# EAGLE design PROJECT_2 (EAGLE 9.6.2)
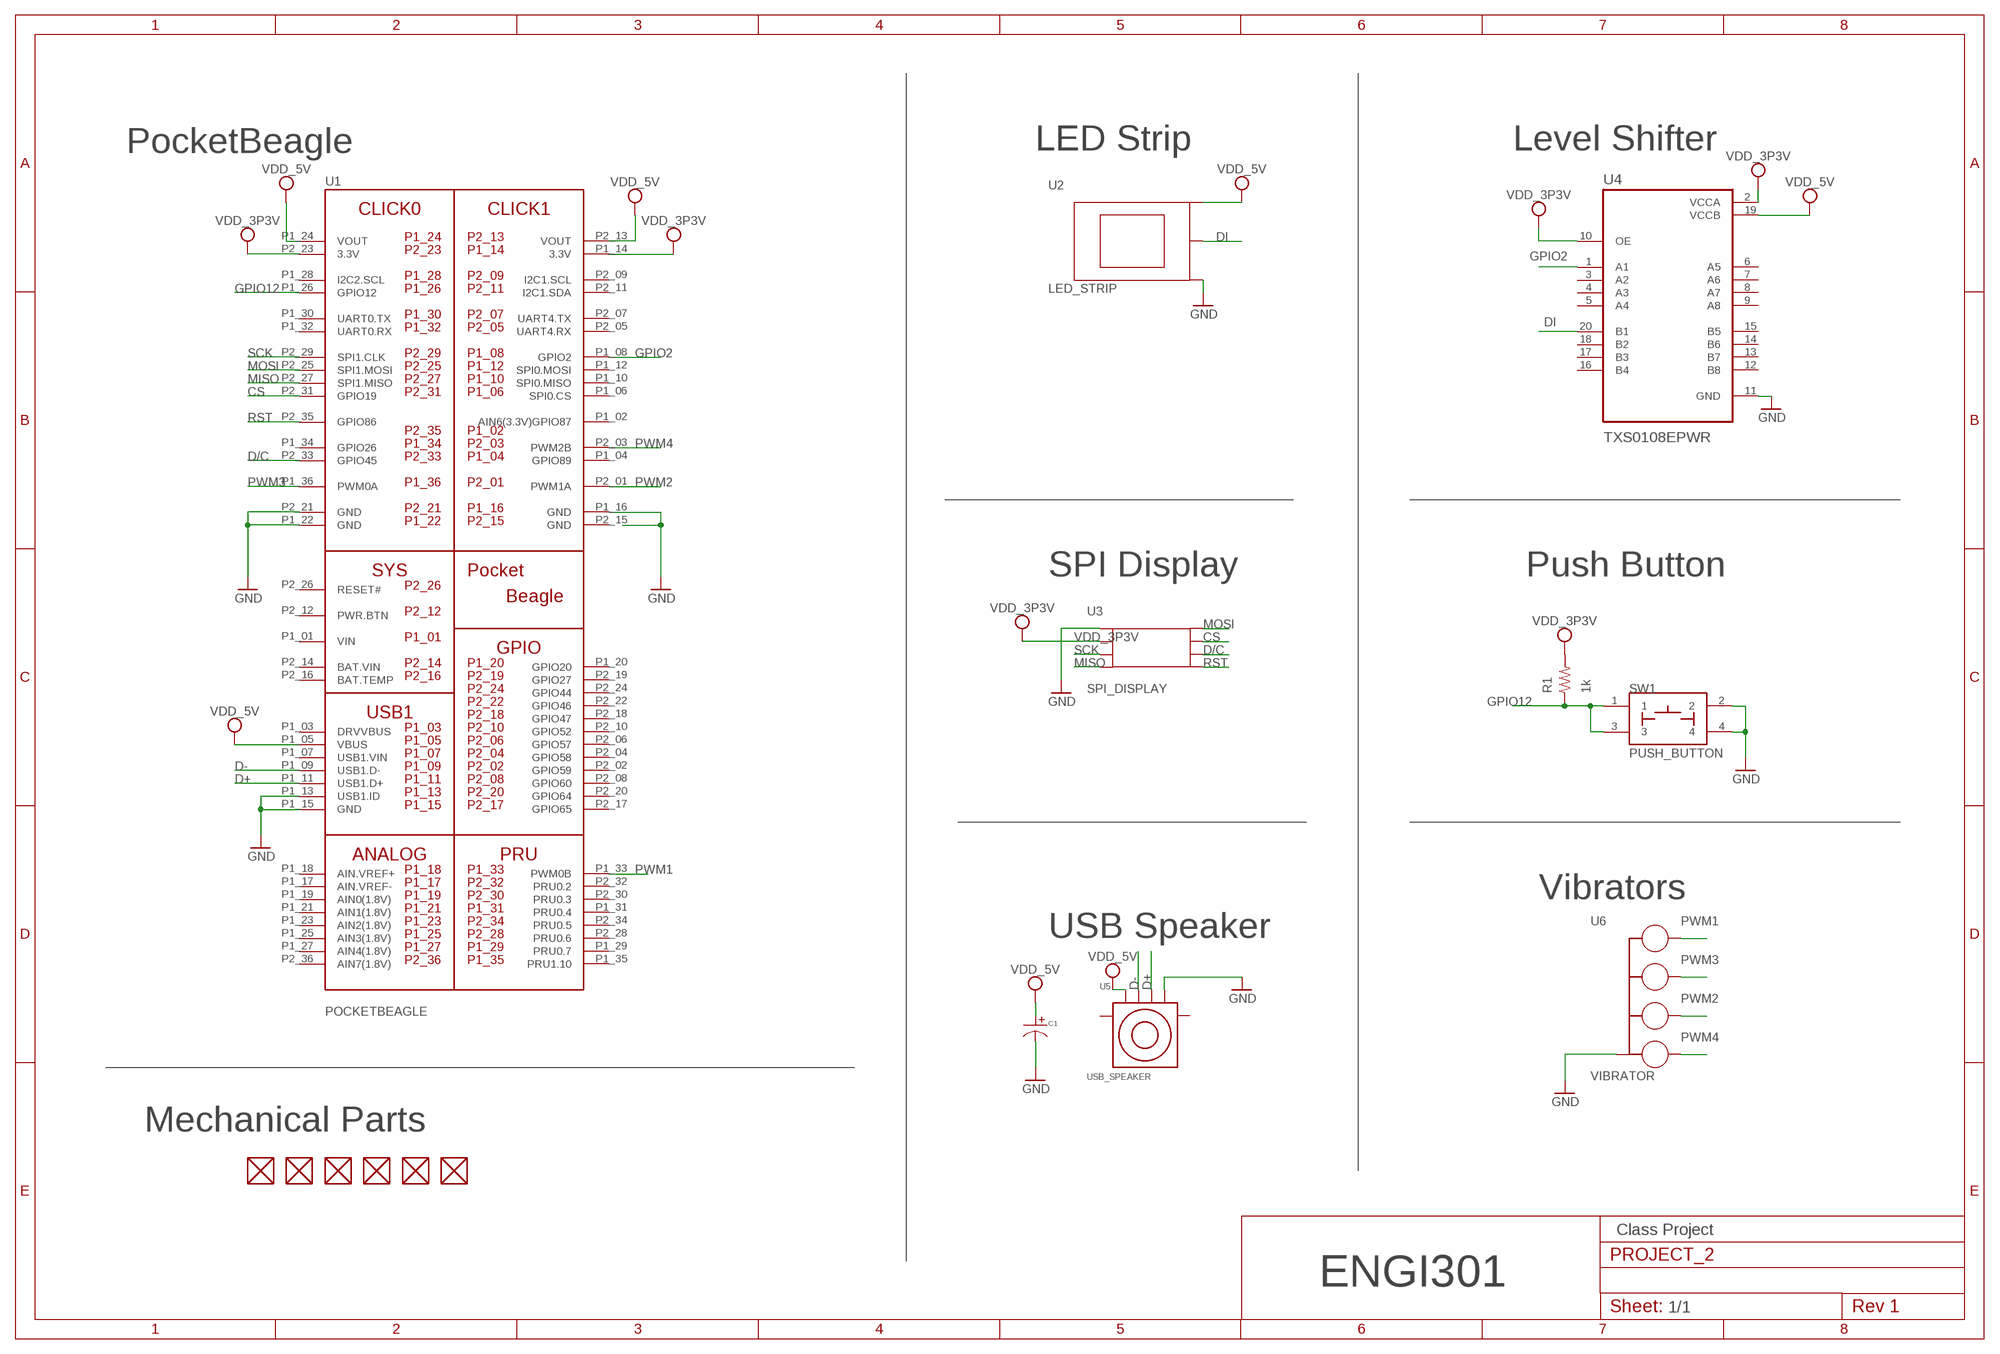
[diagram p0: schematic, sheet 1]

## Parts
C1  CAPACITOR_P_10MM  [CP10MM]
FUD1  FIDUCIAL  [FIDUCIAL_40MIL]
FUD2  FIDUCIAL  [FIDUCIAL_40MIL]
FUD3  FIDUCIAL  [FIDUCIAL_40MIL]
FUD4  FIDUCIAL  [FIDUCIAL_40MIL]
FUD5  FIDUCIAL  [FIDUCIAL_40MIL]
FUD6  FIDUCIAL  [FIDUCIAL_40MIL]
R1  1k  R_R0603  [R0603]
SW1  PUSH_BUTTON  [BUTTON_12.5MM]
U1  POCKETBEAGLE  [POCKETBEAGLE]
U2  LED_STRIP  [LED_HEADERS]
U3  SPI_DISPLAY  [SPI_DISPLAY]
U4  TXS0108EPWR  [SOP65P640X120-20N]
U5  USB_SPEAKER  [USB_CONNECTOR]
U6  VIBRATOR  [VIBRATOR_HEADERS]

## Nets
CS: U1.P2_31(GPIO19) U3.TFT-CS(CS)
D+: U1.P1_11(USB1.D+) U5.D+
D-: U1.P1_09(USB1.D-) U5.D-
D/C: U1.P2_33(GPIO45) U3.D/C
DI: U2.SIG U4.20(B1)
GND: C1.P$2 SW1.2 SW1.4 U1.P1_13(USB1.ID) U1.P1_15(GND) U1.P1_16(GND) U1.P1_22(GND) U1.P2_21(GND) U2.GND U3.GND U4.11(GND) U5.GND U6.GND
GPIO2: U1.P1_08(GPIO2) U4.1(A1)
GPIO12: R1.1 SW1.1 SW1.3 U1.P1_26(GPIO12)
MISO: U1.P2_27(SPI1.MISO) U3.MISO
MOSI: U1.P2_25(SPI1.MOSI) U3.MOSI
PWM1: U1.P1_33(PWM0B) U6.PWM1
PWM2: U1.P2_01(PWM1A) U6.PWM3
PWM3: U1.P1_36(PWM0A) U6.PWM2
PWM4: U1.P2_03(PWM2B) U6.PWM4
RST: U1.P2_35(GPIO86) U3.RST
SCK: U1.P2_29(SPI1.CLK) U3.SCK
VDD_3P3V: R1.2 U1.P1_14(3.3V) U1.P2_23(3.3V) U3.VCC U4.2(VCCA) U4.10(OE)
VDD_5V: C1.P$1 U1.P1_05(VBUS) U1.P1_24(VOUT) U1.P2_13(VOUT) U2.PWR(VIN) U4.19(VCCB) U5.VBUS
Unconnected: FUD1.P$1 FUD2.P$1 FUD3.P$1 FUD4.P$1 FUD5.P$1 FUD6.P$1 U1.P1_02(AIN6(3.3V)GPIO87) U1.P1_03(DRVVBUS) U1.P1_04(GPIO89) U1.P1_06(SPI0.CS) U1.P1_07(USB1.VIN) U1.P1_10(SPI0.MISO) U1.P1_12(SPI0.MOSI) U1.P1_17(AIN.VREF-) U1.P1_18(AIN.VREF+) U1.P1_19(AIN0(1.8V)) U1.P1_20(GPIO20) U1.P1_21(AIN1(1.8V)) U1.P1_23(AIN2(1.8V)) U1.P1_25(AIN3(1.8V)) U1.P1_27(AIN4(1.8V)) U1.P1_28(I2C2.SCL) U1.P1_29(PRU0.7) U1.P1_30(UART0.TX) U1.P1_31(PRU0.4) U1.P1_32(UART0.RX) U1.P1_34(GPIO26) U1.P1_35(PRU1.10) U1.P2_02(GPIO59) U1.P2_04(GPIO58) U1.P2_05(UART4.RX) U1.P2_06(GPIO57) U1.P2_07(UART4.TX) U1.P2_08(GPIO60) U1.P2_09(I2C1.SCL) U1.P2_10(GPIO52) U1.P2_11(I2C1.SDA) U1.P2_12(PWR.BTN) U1.P2_16(BAT.TEMP) U1.P2_17(GPIO65) U1.P2_18(GPIO47) U1.P2_19(GPIO27) U1.P2_20(GPIO64) U1.P2_22(GPIO46) U1.P2_24(GPIO44) U1.P2_26(RESET#) U1.P2_28(PRU0.6) U1.P2_30(PRU0.3) U1.P2_32(PRU0.2) U1.P2_34(PRU0.5) U1.P2_36(AIN7(1.8V)) U4.3(A2) U4.4(A3) U4.5(A4) U4.6(A5) U4.7(A6) U4.8(A7) U4.9(A8) U4.12(B8) U4.13(B7) U4.14(B6) U4.15(B5) U4.16(B4) U4.17(B3) U4.18(B2) U5.SHIELD@1(CGND) U5.SHIELD@2(CGND1)

## Notes on the sheet
- PocketBeagle | LED Strip | Level Shifter
- SPI Display | Push Button
- Vibrators
- USB Speaker
- Mechanical Parts
- Class Project
- ENGI301
- 1/1

## Power pins joined to a net without a drawn wire
BAT.VIN: U1.P2_14(BAT.VIN)
GND: U1.P2_15(GND)
VIN: U1.P1_01(VIN)

## Library data of the parts
C1 = MF_Passives:CAPACITOR_P: Library: MF_Passives Description: Device for Polarized Capacitors. Manufacture part number (MPN), Voltage Rating, and Tolerance can be added via Attributes. Check https://factory.macrofab.com/parts for the house parts list.; POPULATE: 1
FUD1-FUD6 = combo_lock:FIDUCIAL
R1 = Project_2:R_: RESISTOR, American symbol
SW1 = Project_2:PUSH_BUTTON
U1 = Project_2:POCKETBEAGLE
U2 = Project_2:LED_STRIP: LED Strip
U3 = Project_2:SPI_DISPLAY: 1.8" Color TFT LCD display
U4 = Project_2:TXS0108EPWR: Check prices <https://pricing.snapeda.com/parts/TXS0108EPWR/Texas%20Instruments/view-part?ref=eda>; AVAILABILITY: In Stock; DESCRIPTION: 8-bit bidirectional voltage-level shifter for open-drain and push-pull application 20-TSSOP -40 to 85; MF: Texas Instruments; MP: TXS0108EPWR; PACKAGE: TSSOP-20 Texas Instruments; PRICE: None; PURCHASE-URL: https://pricing.snapeda.com/search/part/TXS0108EPWR/?ref=eda
U5 = Project_2:USB_SPEAKER
U6 = Project_2:VIBRATOR: Vibration motor

## Board
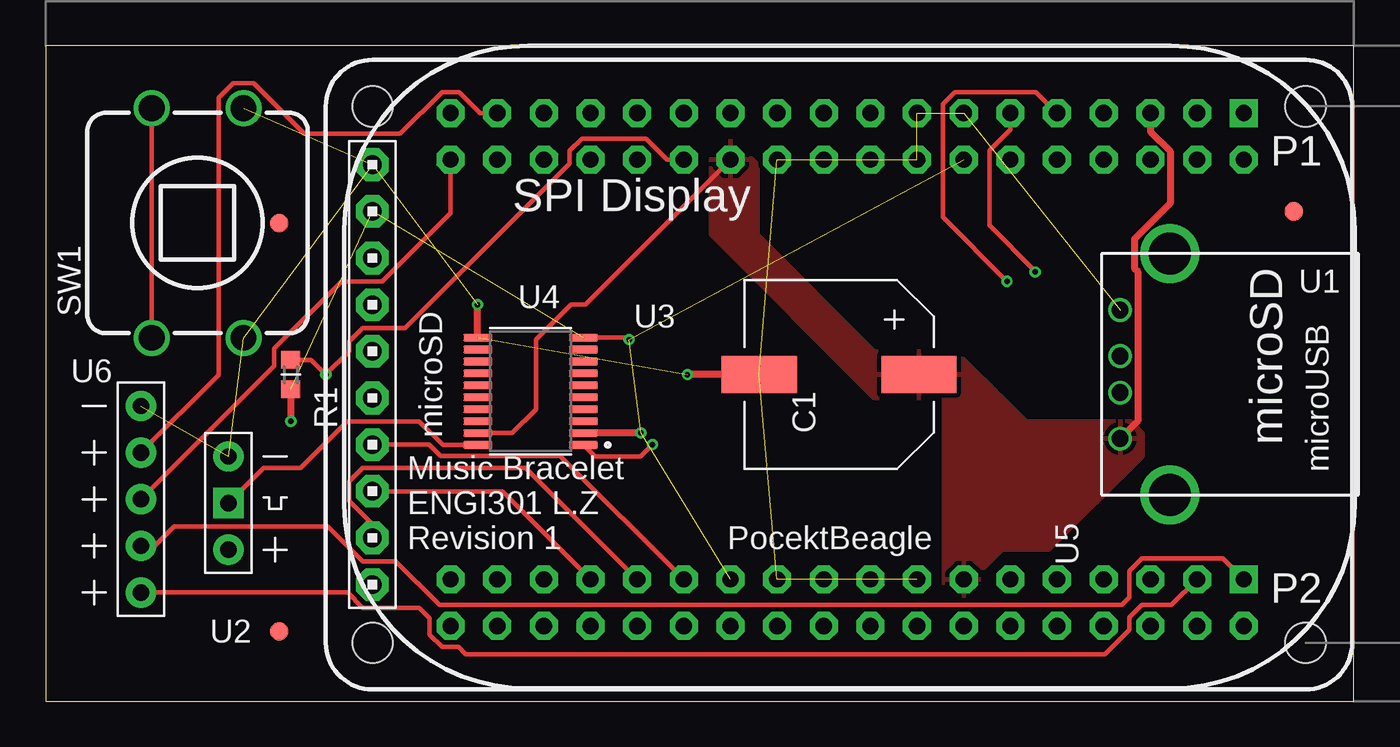
[diagram p1: board, top side]
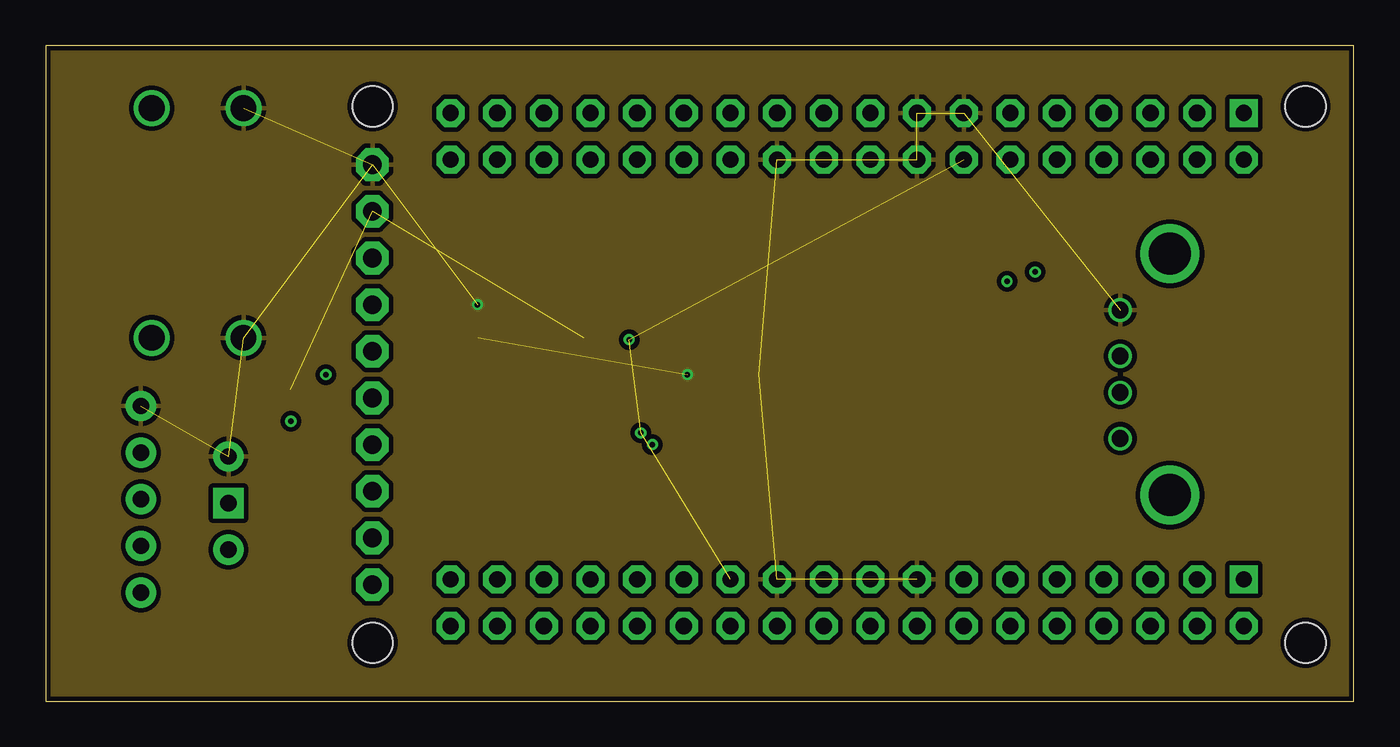
[diagram p2: board, inner layer Route2]
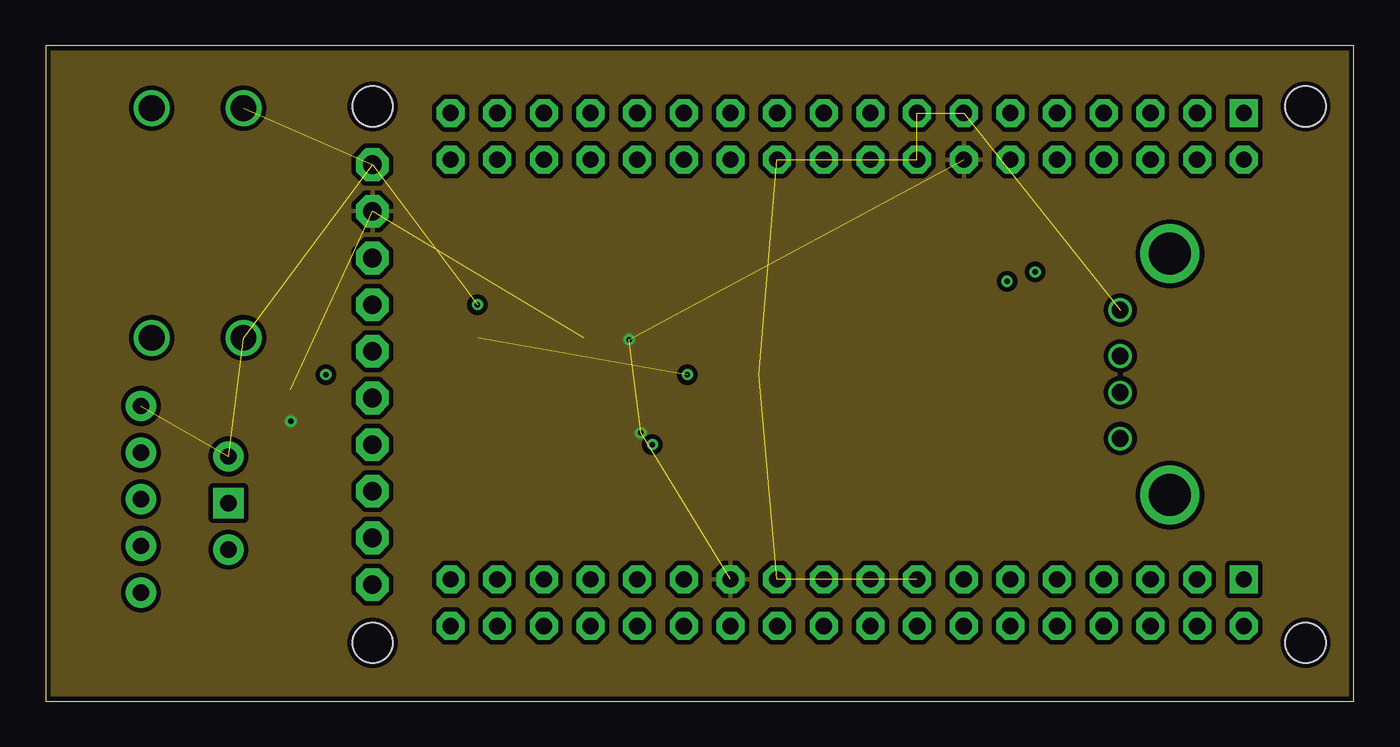
[diagram p3: board, inner layer Route15]
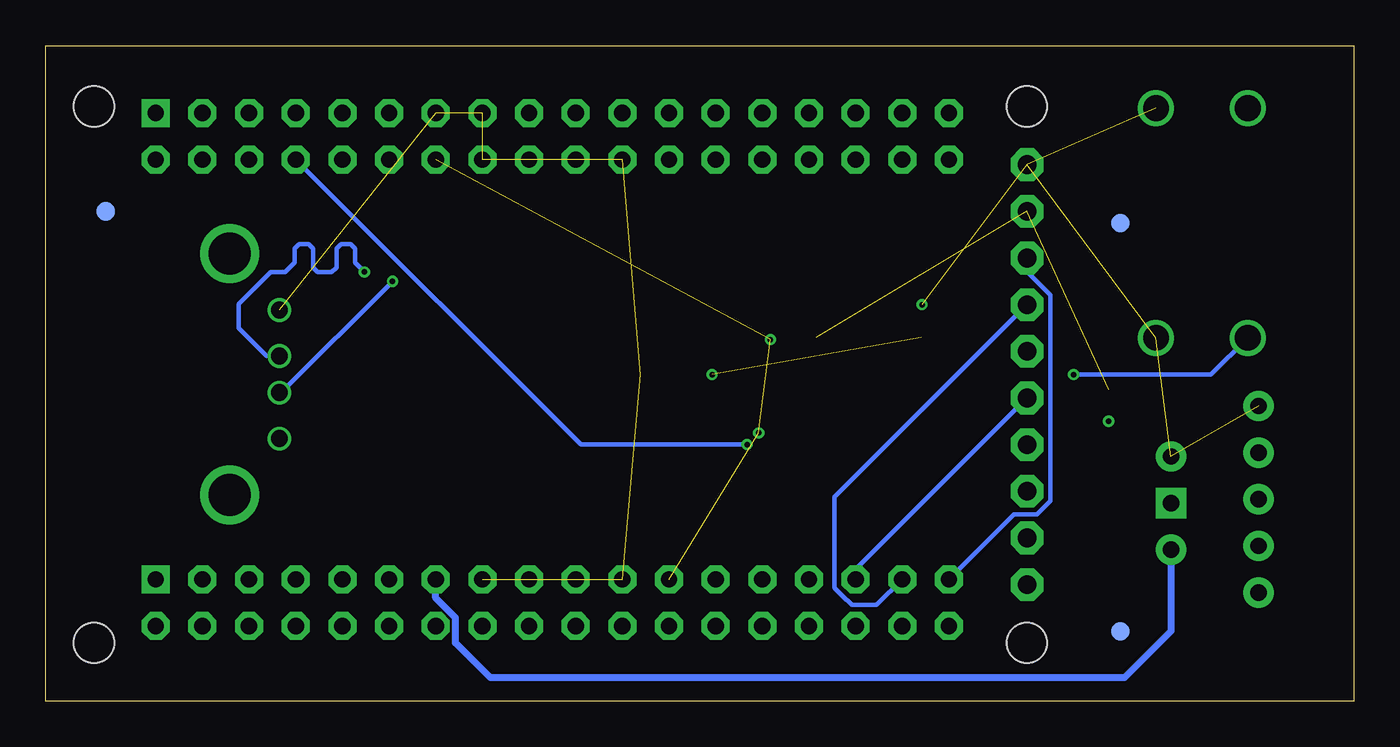
[diagram p4: board, bottom side, seen from below]

Size 71.19 x 35.68 mm. Coordinates in mm from the lower left corner, seen from the top.
Outline: 0,0 71.19,0 71.19,35.68 0,35.68 0,0
Copper layers (1*2*15*16): Top 0.035mm / dielectric 0.23mm / Route2 0.035mm / dielectric 0.93mm / Route15 0.035mm / dielectric 0.23mm / Bottom 0.035mm
Design rules "ENGI301_4lyr *": minimum track width 10mil, minimum drill 12mil, track to track 10mil, track to pad 5mil, pad to pad 5mil, via to via 10mil, smd to smd 10mil, copper to edge 10mil, drill to drill 12mil, minimum pad ring 6mil, minimum via ring 6mil, stop-mask expansion 3mil, vias tented up to drill 25mil, thermal gap 10mil

### Footprints (pad centres in the part's own frame; a part is rotated, then mirrored left to right if it is on the bottom)
CP10MM = smd 2 x 4.1: P$1 0,-4.35; P$2 0,4.35
FIDUCIAL_40MIL = smd 1.016 x 1.016: P$1 0,0
R0603 = smd 0.95 x 1.031: 1 -0.8,0; 2 0.8,0
BUTTON_12.5MM = drill 1.4: 1 -6.25,2.5; 2 -6.25,-2.5; 3 6.25,2.5; 4 6.25,-2.5
POCKETBEAGLE = drill 0.889 pad 1.524 square: P1_01 5.91,3.53; P2_01 5.91,28.93 | drill 0.889 pad 1.524 octagon: P1_02 5.91,6.07; P1_03 8.45,3.53; P1_04 8.45,6.07; P1_05 10.99,3.53; P1_06 10.99,6.07; P1_07 13.53,3.53; P1_08 13.53,6.07; P1_09 16.07,3.53; P1_10 16.07,6.07; P1_11 18.61,3.53; P1_12 18.61,6.07; P1_13 21.15,3.53; P1_14 21.15,6.07; P1_15 23.69,3.53; P1_16 23.69,6.07; P1_17 26.23,3.53; P1_18 26.23,6.07; P1_19 28.77,3.53; P1_20 28.77,6.07; P1_21 31.31,3.53; P1_22 31.31,6.07; P1_23 33.85,3.53; P1_24 33.85,6.07; P1_25 36.39,3.53; P1_26 36.39,6.07; P1_27 38.93,3.53; P1_28 38.93,6.07; P1_29 41.47,3.53; P1_30 41.47,6.07; P1_31 44.01,3.53; P1_32 44.01,6.07; P1_33 46.55,3.53; P1_34 46.55,6.07; P1_35 49.09,3.53; P1_36 49.09,6.07; P2_02 5.91,31.47; P2_03 8.45,28.93; P2_04 8.45,31.47; P2_05 10.99,28.93; P2_06 10.99,31.47; P2_07 13.53,28.93; P2_08 13.53,31.47; P2_09 16.07,28.93; P2_10 16.07,31.47; P2_11 18.61,28.93; P2_12 18.61,31.47; P2_13 21.15,28.93; P2_14 21.15,31.47; P2_15 23.69,28.93; P2_16 23.69,31.47; P2_17 26.23,28.93; P2_18 26.23,31.47; P2_19 28.77,28.93; P2_20 28.77,31.47; P2_21 31.31,28.93; P2_22 31.31,31.47; P2_23 33.85,28.93; P2_24 33.85,31.47; P2_25 36.39,28.93; P2_26 36.39,31.47; P2_27 38.93,28.93; P2_28 38.93,31.47; P2_29 41.47,28.93; P2_30 41.47,31.47; P2_31 44.01,28.93; P2_32 44.01,31.47; P2_33 46.55,28.93; P2_34 46.55,31.47; P2_35 49.09,28.93; P2_36 49.09,31.47
LED_HEADERS = drill 0.889 pad 1.651: GND 0,-2.54; PWR 0,2.54 | drill 0.889 pad 1.651 square: SIG 0,0
SPI_DISPLAY = drill 1.016 pad 1.778 octagon: CARD-CS 25.4,-1.27; D/C 25.4,-3.81; GND 25.4,-11.43; LITE 25.4,11.43; MISO 25.4,8.89; MOSI 25.4,3.81; RST 25.4,-6.35; SCK 25.4,6.35; TFT-CS 25.4,1.27; VCC 25.4,-8.89 | hole 2.2: -25.4,14.605; 25.4,14.605; -25.4,-14.605; 25.4,-14.605
SOP65P640X120-20N = smd 1.57 x 0.41: 1 -2.87,2.925; 2 -2.87,2.275; 3 -2.87,1.625; 4 -2.87,0.975; 5 -2.87,0.325; 6 -2.87,-0.325; 7 -2.87,-0.975; 8 -2.87,-1.625; 9 -2.87,-2.275; 10 -2.87,-2.925; 11 2.87,-2.925; 12 2.87,-2.275; 13 2.87,-1.625; 14 2.87,-0.975; 15 2.87,-0.325; 16 2.87,0.325; 17 2.87,0.975; 18 2.87,1.625; 19 2.87,2.275; 20 2.87,2.925
USB_CONNECTOR = drill 0.92: D+ 7.565,12.99; D- 5.565,12.99; GND 10.065,12.99; VBUS 3.065,12.99 | drill 2.3: SHIELD@1 -0.005,10.28; SHIELD@2 13.135,10.28
VIBRATOR_HEADERS = drill 0.889 pad 1.651: GND 0,2.54; PWM1 0,0; PWM2 0,-2.54; PWM3 0,-5.08; PWM4 0,-7.62

### Placement (x,y rotation side)
C1  43.18,17.78 90 top
FUD1  12.7,3.81 0 bottom
FUD2  12.7,3.81 0 top
FUD3  12.7,26.04 0 top
FUD4  67.94,26.67 0 top
FUD5  12.7,26.04 0 bottom
FUD6  67.94,26.67 0 bottom
R1  13.34,17.78 270 top
SW1  8.26,26.04 90 top
U1  71.12,35.56 180 top
U2  9.94,10.79 180 top
U3  43.18,17.78 180 top
U4  26.39,16.87 180 top
U5  71.47,11.23 90 top
U6  5.17,13.53 0 top

### Tracks (layer width: path | path; a pad name or v marks a point on that pad's centre or on a via)
CS
  Bottom 0.254: U3.TFT-CS 27.11,7.18 U1.P2_31
D+  (via drill 0.3 pad 0.61)
  Top 0.254: U1.P1_11 52.51,31.11 51.37,29.96 51.37,25.91 53.85,23.43 v53.85,23.37
  Bottom 0.254: U5.D+ 59.18,18.8 60.71,20.32 60.71,21.63 58.97,23.37 58.17,23.37 57.66,23.88 57.66,24.64 57.4,24.89 56.9,24.89 56.64,24.64 56.64,23.62 56.39,23.37 55.63,23.37 55.37,23.62 55.37,24.64 55.12,24.89 54.61,24.89 54.36,24.64 54.36,23.88 v53.85,23.37
D-  (via drill 0.3 pad 0.61)
  Top 0.254: U1.P1_09 53.91,33.17 49.5,33.17 48.83,32.5 48.83,26.36 v52.32,22.86
  Bottom 0.254: v52.32,22.86 58.39,16.8 U5.D-
D/C
  Bottom 0.254: U3.D/C 28.25,11.12 28.25,6.16 27.58,5.49 27.56,5.49 27.3,5.23 25.97,5.23 U1.P2_33
DI
  Top 0.254: U4.20 21.61,13.95 20.32,15.24 16.4,15.24 13.86,12.7 11.86,12.7 U2.SIG
GND  (via drill 0.3 pad 0.61)  (13 unrouted)
  Top 0.254: U4.11 23.5,19.82
  Top 0.381: 23.5,19.82 v23.5,21.59 | C1.P$2 v34.92,17.78
  pour Route2: -2.54,38.1 73.66,38.1 73.66,-2.54 -2.54,-2.54
GPIO2  (via drill 0.3 pad 0.61)
  Top 0.254: v33.02,13.97 32.36,13.31 29.89,13.31 U4.1
  Bottom 0.254: U1.P1_08 42.07,13.97 v33.02,13.97
GPIO12  (via drill 0.3 pad 0.61)
  Top 0.254: SW1.3 SW1.1 | R1.1 14.44,18.58 v15.24,17.78 16.51,19.05 16.51,19.58 17.25,20.32 19.56,20.32 28.51,29.27 28.51,29.96 29.18,30.63 32.66,30.63 33.81,29.49 U1.P1_26
  Bottom 0.254: SW1.1 7.76,17.78 v15.24,17.78
MISO
  Top 0.254: U1.P2_27 26.12,12.7 17.25,12.7 16.51,11.96 16.51,10.9 17.78,9.63 U3.MISO
MOSI
  Top 0.254: U3.MOSI 20.87,13.97 21.48,13.36 28,13.36 U1.P2_25
PWM1
  Top 0.254: U6.PWM1 9.39,17.75 9.39,32.85 10.19,33.65 11.32,33.65 14.06,30.9 19.29,30.9 21.56,33.17 22.5,33.17 23.65,32.03 U1.P1_33
PWM2
  Top 0.254: U6.PWM3 5.91,8.45 6.99,9.53 15.35,9.53 17.25,7.62 19.05,7.62 21.44,5.23 58.57,5.23 58.99,5.65 58.99,7.1 59.66,7.77 64.07,7.77 U1.P2_01
PWM3
  Top 0.254: U6.PWM2 12.44,18.26 12.44,19.21 16.09,22.86 18.31,22.86 22.03,26.58 U1.P1_36
PWM4
  Top 0.254: U6.PWM4 16.42,5.91 17.25,5.08 20.32,5.08 20.89,4.51 20.89,3.62 21.56,2.95 22.45,2.95 22.86,2.54 57.66,2.54 58.99,3.87 58.99,4.56 59.66,5.23 61.27,5.23 U1.P2_03
RST
  Bottom 0.254: U3.RST 17.78,23.39 16.51,22.12 16.51,10.9 17.25,10.16 18.5,10.16 U1.P2_35
SCK
  Top 0.254: U3.SCK 24.85,11.43 U1.P2_29
VDD_3P3V  (via drill 0.3 pad 0.61)  (5 unrouted)
  Top 0.254: U4.10 31.64,19.8 v31.75,19.68
  Top 0.381: R1.2 v13.34,15.24 | U4.2 v32.38,14.61
  pour Route15: -5.08,40.64 -5.08,-5.08 76.2,-5.08 76.2,40.64
VDD_5V
  Top 0.254: U1.P1_24 29.37,21.59 28.57,21.59 26.67,19.68 26.67,15.88 25.39,14.6 U4.19
  Top 0.381: U1.P1_05 60.13,31.02 61.21,29.94 61.21,27.11 59.26,25.16 59.26,23.57 59.44,23.39 59.44,15.26 U5.VBUS
  Bottom 0.381: U2.PWR 9.94,3.8 12.47,1.27 46.99,1.27 48.89,3.17 48.89,4.54 49.97,5.62 U1.P2_13
  pour Top: 36.83,30.48 37.47,30.48 38.73,29.21 38.73,25.4 45.09,19.05 49.53,19.05 53.34,15.24 59.05,15.24 59.69,14.61 59.69,13.34 54.61,8.26 52.07,8.26 50.8,6.99 50.8,6.35 50.16,5.71 49.53,5.71 48.9,6.35 48.9,16.51 45.09,16.51 36.2,25.4 36.2,29.84

### Text on the board
tPlace: Music Bracelet / ENGI301 L.Z / Revision 1